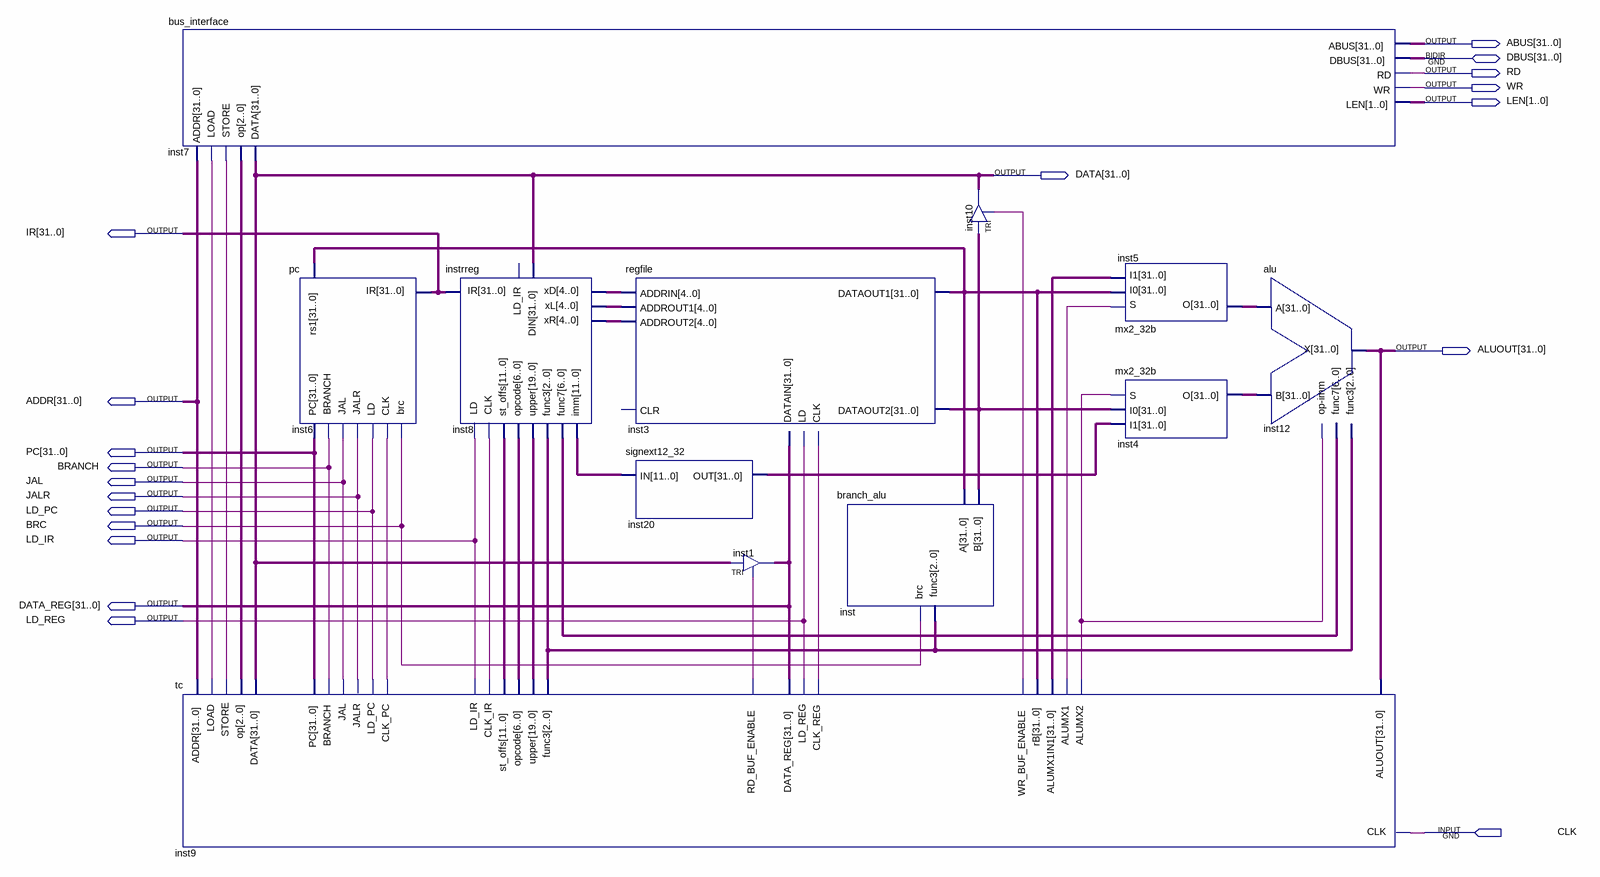
[diagram p0: schematic sheet]
// Quartus schematic rv32i_debug.bdf as structural Verilog: 12 symbols, 19 pins
module rv32i_debug (
  input  CLK,
  inout  [31:0] DBUS,
  output [31:0] ABUS,
  output RD,
  output WR,
  output [1:0] LEN,
  output [31:0] DATA,
  output [31:0] IR,
  output [31:0] ALUOUT,
  output [31:0] ADDR,
  output [31:0] PC,
  output BRANCH,
  output JAL,
  output JALR,
  output LD_PC,
  output BRC,
  output LD_IR,
  output [31:0] DATA_REG,
  output LD_REG
);

  wire inst9_alumx1, inst9_alumx2, inst9_clk_ir, inst9_clk_pc, inst9_clk_reg, inst9_load,
       inst9_rd_buf_enable, inst9_store, inst9_wr_buf_enable;
  wire [2:0] inst8_func3, inst9_op;
  wire [4:0] inst8_xd, inst8_xl, inst8_xr;
  wire [6:0] inst8_func7, inst8_opcode;
  wire [11:0] inst8_imm, inst8_st_offs;
  wire [19:0] inst8_upper;
  wire [31:0] inst3_dataout1, inst3_dataout2, inst4_o, inst5_o, inst9_alumx1in1, inst20_out;

  bus_interface inst7 (
    .LOAD(inst9_load), .STORE(inst9_store), .op(inst9_op), .ADDR(ADDR), .ABUS(ABUS), .RD(RD), .WR(WR),
    .LEN(LEN), .DBUS(DBUS), .DATA(DATA));
  tc inst9 (
    .st_offs(inst8_st_offs), .func3(inst8_func3), .opcode(inst8_opcode), .CLK(CLK), .ALUOUT(ALUOUT),
    .upper(inst8_upper), .DATA(DATA), .PC(PC), .rB(inst3_dataout1), .op(inst9_op), .CLK_PC(inst9_clk_pc),
    .CLK_IR(inst9_clk_ir), .CLK_REG(inst9_clk_reg), .ALUMX1IN1(inst9_alumx1in1), .LD_PC(LD_PC),
    .LD_IR(LD_IR), .ALUMX1(inst9_alumx1), .LD_REG(LD_REG), .BRANCH(BRANCH), .DATA_REG(DATA_REG), .JAL(JAL),
    .ALUMX2(inst9_alumx2), .JALR(JALR), .LOAD(inst9_load), .STORE(inst9_store), .ADDR(ADDR),
    .WR_BUF_ENABLE(inst9_wr_buf_enable), .RD_BUF_ENABLE(inst9_rd_buf_enable));
  pc inst6 (
    .brc(BRC), .BRANCH(BRANCH), .JAL(JAL), .JALR(JALR), .IR(IR), .rs1(inst3_dataout1), .LD(LD_PC),
    .CLK(inst9_clk_pc), .PC(PC));
  instrreg inst8 (
    .DIN(DATA), .LD(LD_IR), .CLK(inst9_clk_ir), .IR(IR), .opcode(inst8_opcode), .func7(inst8_func7),
    .xR(inst8_xr), .xL(inst8_xl), .func3(inst8_func3), .xD(inst8_xd), .imm(inst8_imm), .upper(inst8_upper),
    .st_offs(inst8_st_offs));  // open: LD_IR
  regfile inst3 (
    .LD(LD_REG), .ADDRIN(inst8_xd), .DATAIN(DATA_REG), .CLK(inst9_clk_reg), .ADDROUT1(inst8_xl),
    .ADDROUT2(inst8_xr), .DATAOUT2(inst3_dataout2), .DATAOUT1(inst3_dataout1));  // open: CLR
  signext12_32 inst20 (.IN(inst8_imm), .OUT(inst20_out));
  TRI inst1[31:0] (.IN(DATA), .OE(inst9_rd_buf_enable), .OUT(DATA_REG));
  branch_alu inst (.A(inst3_dataout1), .B(inst3_dataout2), .func3(inst8_func3), .brc(BRC));
  TRI inst10[31:0] (.IN(inst3_dataout2), .OE(inst9_wr_buf_enable), .OUT(DATA));
  mx2_32b inst5 (.S(inst9_alumx1), .I0(inst3_dataout1), .I1(inst9_alumx1in1), .O(inst5_o));
  mx2_32b inst4 (.S(inst9_alumx2), .I0(inst3_dataout2), .I1(inst20_out), .O(inst4_o));
  alu inst12 (.A(inst5_o), .B(inst4_o), .func3(inst8_func3), .\op-imm (inst9_alumx2), .func7(inst8_func7), .X(ALUOUT));
endmodule
